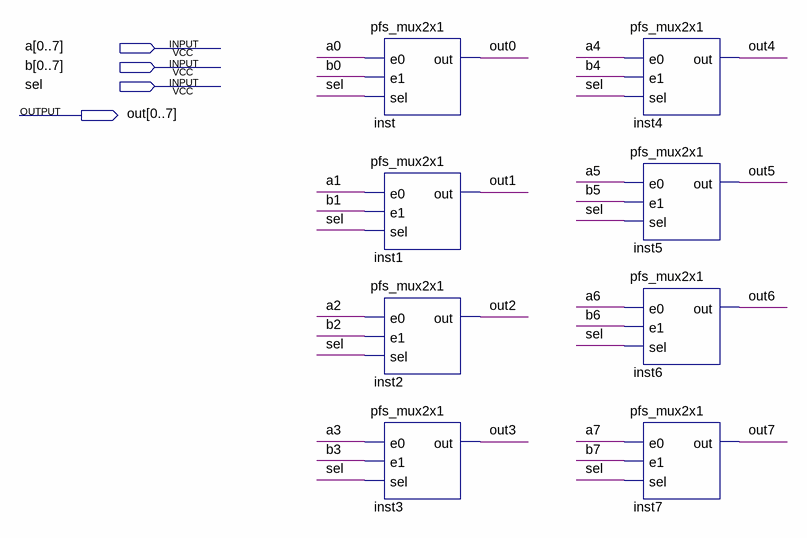
[diagram p0: schematic sheet]
// Quartus schematic pfs_mux2x1_8bit.bdf as structural Verilog: 8 symbols, 4 pins
module pfs_mux2x1_8bit (
  input  [0:7] a,
  input  [0:7] b,
  input  sel,
  output [0:7] out
);

  pfs_mux2x1 inst (.e0(a[0]), .e1(b[0]), .sel(sel), .out(out[0]));
  pfs_mux2x1 inst1 (.e0(a[1]), .e1(b[1]), .sel(sel), .out(out[1]));
  pfs_mux2x1 inst2 (.e0(a[2]), .e1(b[2]), .sel(sel), .out(out[2]));
  pfs_mux2x1 inst3 (.e0(a[3]), .e1(b[3]), .sel(sel), .out(out[3]));
  pfs_mux2x1 inst4 (.e0(a[4]), .e1(b[4]), .sel(sel), .out(out[4]));
  pfs_mux2x1 inst5 (.e0(a[5]), .e1(b[5]), .sel(sel), .out(out[5]));
  pfs_mux2x1 inst6 (.e0(a[6]), .e1(b[6]), .sel(sel), .out(out[6]));
  pfs_mux2x1 inst7 (.e0(a[7]), .e1(b[7]), .sel(sel), .out(out[7]));
endmodule
